# Altium schematic sheet Supply.SchDoc
size A4; SheetNumber: 1; SheetTotal: 4
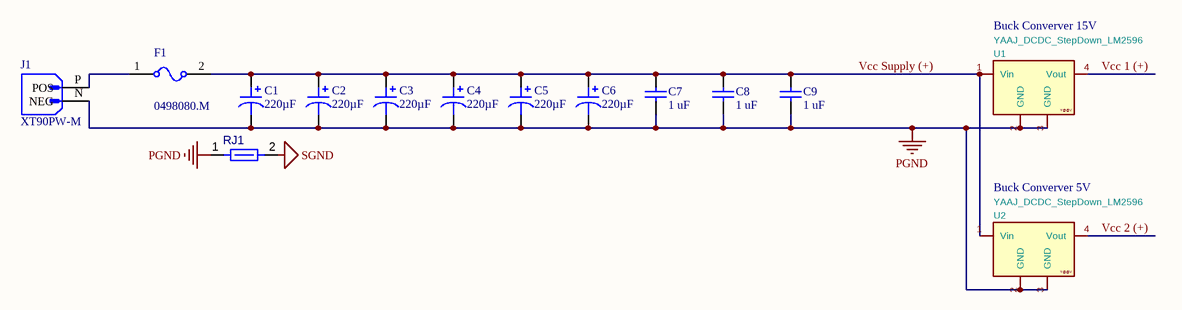
[diagram p0: Supply.SchDoc]

## Parts
C1  220µF  [CAP TH ALUM ELEC D10.00mm S5.00mm H20.00mm]
C2  220µF  [CAP TH ALUM ELEC D10.00mm S5.00mm H20.00mm]
C3  220µF  [CAP TH ALUM ELEC D10.00mm S5.00mm H20.00mm]
C4  220µF  [CAP TH ALUM ELEC D10.00mm S5.00mm H20.00mm]
C5  220µF  [CAP TH ALUM ELEC D10.00mm S5.00mm H20.00mm]
C6  220µF  [CAP TH ALUM ELEC D10.00mm S5.00mm H20.00mm]
C7  1 uF  [CAPR51-254-508X318X736]
C8  1 uF  [CAPR51-254-508X318X736]
C9  1 uF  [CAPR51-254-508X318X736]
F1  0498080.M  [0498080M]
J1  XT90PW-M  [AMASS_XT90PW-M]
RJ1  Net Tie 0.6x1.4mm  [SHORT10_8MIL-FP]  (value not drawn)  (net tie, no BOM)
U1  Buck Converver 15V  value YAAJ_DCDC_StepDown_LM2596  [YAAJ_DCDC_StepDown_LM2596]
U2  Buck Converver 5V  value YAAJ_DCDC_StepDown_LM2596  [YAAJ_DCDC_StepDown_LM2596]

## Nets
PGND: C1.2 C2.2 C3.2 C4.2 C5.2 C6.2 C7.1 C8.1 C9.1 J1.N(NEG) RJ1.1 U1.2(GND) U1.3(GND) U2.2(GND) U2.3(GND)
SGND: RJ1.2
Vcc 1 (+): U1.4(Vout)
Vcc 2 (+): U2.4(Vout)
Vcc Supply (+): C1.1 C2.1 C3.1 C4.1 C5.1 C6.1 C7.2 C8.2 C9.2 F1.2 U1.1(Vin) U2.1(Vin)
NetF1_1: F1.1 J1.P(POS)

## Notes on the sheet
- (in symbol YAAJ_DCDC_StepDown_LM2596) Y@@V

## Library data of the parts
C1 C3-C6 = UPW1J221MPD: CAP ALUM 220UF 20% 63V RADIAL; manufacturer: Nichicon; Impedance: 147 mOhms; Lifetime @ Temp.: 5000 Hrs @ 105°C; Polarization: Polar; Ripple Current @ High Frequency: 885mA @ 100kHz; Ripple Current @ Low Frequency: 575.25mA @ 120Hz; Part Number: UPW1J221MPD; Applications: General Purpose; Capacitance: 220µF; componentlink1description: Datasheet; componentlink1url: http://nichicon-us.com/english/products/pdfs/e-upw.pdf; componentlink2description: DigiKey Link; componentlink2url: http://digikey.com/product-detail/en/nichicon/UPW1J221MPD/493-1942-ND/589683; Device Package: Radial, Can; Height - Seated (Max): 0.787" (20.00mm); lastupdated: 02/09/2020 01:31:30; Lead Spacing: 0.197" (5.00mm); Lifecycle Status: Active; Minimum Order: 1; Mounting Type: Through Hole; Operating Temperature: -55°C ~ 105°C; Package / Case: Radial, Can; packaging: Bulk; partid: 12422; Part Status: Active; price: 0.65; series: UPW; Size / Dimension: 0.394" Dia (10.00mm); Supplier 1: DigiKey; Supplier Part Number 1: 493-1942-ND; Tolerance: ±20%; value: 220µF; Voltage - Rated: 63V
C2 = UPW1J221MPD: UPW1J221MPD / CAP ALUM 220UF 20% 63V RADIAL; manufacturer: Nichicon; Impedance: 147 mOhms; Lifetime @ Temp.: 5000 Hrs @ 105°C; Polarization: Polar; Ripple Current @ High Frequency: 885mA @ 100kHz; Ripple Current @ Low Frequency: 575.25mA @ 120Hz; Part Number: UPW1J221MPD; Applications: General Purpose; Capacitance: 220µF; componentlink1description: Datasheet; componentlink1url: http://nichicon-us.com/english/products/pdfs/e-upw.pdf; componentlink2description: DigiKey Link; componentlink2url: http://digikey.com/product-detail/en/nichicon/UPW1J221MPD/493-1942-ND/589683; Device Package: Radial, Can; Height - Seated (Max): 0.787" (20.00mm); lastupdated: 02/09/2020 01:31:30; Lead Spacing: 0.197" (5.00mm); Lifecycle Status: Active; Minimum Order: 1; Mounting Type: Through Hole; Operating Temperature: -55°C ~ 105°C; Package / Case: Radial, Can; packaging: Bulk; partid: 12422; Part Status: Active; price: 0.65; series: UPW; Size / Dimension: 0.394" Dia (10.00mm); Supplier 1: DigiKey; Supplier Part Number 1: 493-1942-ND; Tolerance: ±20%; value: 220µF; Voltage - Rated: 63V
C7-C9 = CMP-1664-00004-1: Radial Leaded Multilayer Ceramic Capacitor, 0.1 uF, +/- 10%, 50 V, -55 to 125 degC, 2-Pin THD, RoHS, Tape and Reel; Case\Package: SOT-23-5; Max Power Dissipation: 250 mW; Output Current: 150 mA; Dropout Voltage: 260 mV; Outputs: 1; Output Voltage: 5 V; Max Input Voltage: 8 V; Min Operating Temperature: -40 degC; Packaging: Tape and Reel; Height: 1.3 mm; Radiation Hardening: No; Pins: 5; ComponentLink1Description: Manufacturer URL; Mount: Surface Mount; RoHSCompliant: true; Max Operating Temperature: 85 degC; PackageReference: CAPR51-254-508X318X736; ComponentLink2URL: http://www.kemet.com/docfinder?Partnumber=C320C104K5R5TA; PackageDescription: 2-Pin Through Hole Device, Body 5.08 x 3.18 mm, Pitch 2.54 mm; ComponentLink1URL: http://www.kemet.com/; Width: 1.8 mm; Package Quantity: 3000; DatasheetVersion: Dec-15; Length: 3 mm; ComponentLink2Description: Datasheet
F1 = Fuse: 80 A 32 V Fuse Automotive Bolt Mount Auto Link; RESISTANCE: 1m; SimulationGenericComponent: True; CURRENT: 80
J1 = XT90PW-M: Socket; DC supply; XT90; male; PIN: 2; on PCBs; THT; Colour: yellow; MF: AMASS; SnapEDA_Link: https://www.snapeda.com/parts/XT90PW-M/AMASS/view-part/?ref=snap; Package: Package; Value: *; MP: XT90PW-M; Check_prices: https://www.snapeda.com/parts/XT90PW-M/AMASS/view-part/?ref=eda
RJ1 = CMP-009-00120-2: Max Operating Temperature: 155°C; Min Operating Temperature: -55°C; Pins: 2
U1 U2 = YAAJ_DCDC_StepDown_LM2596